# Altium schematic sheet EmitterConnector.SchDoc
size A4
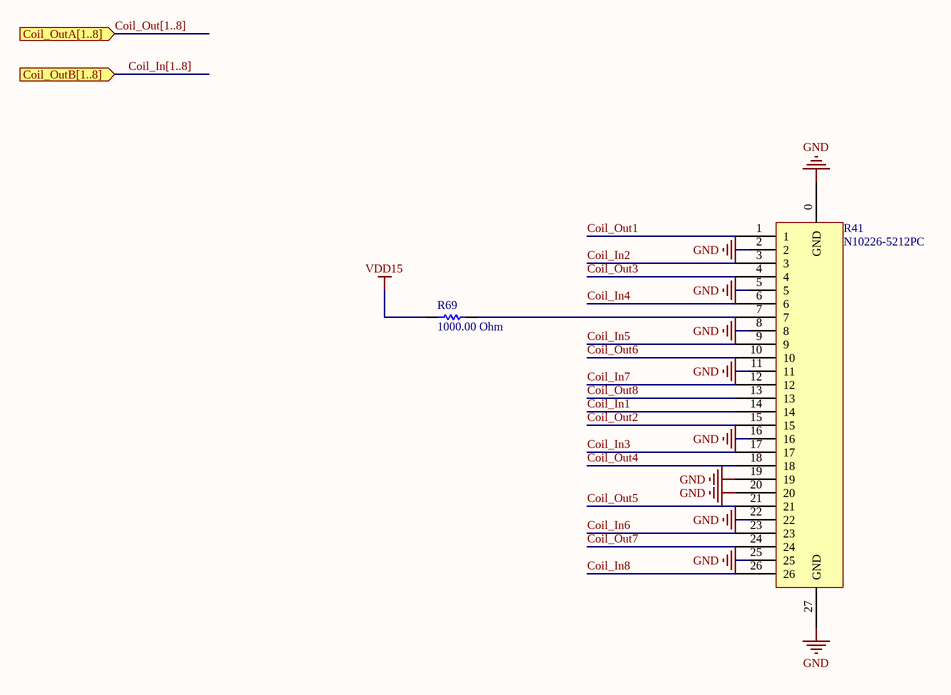
[diagram p0: EmitterConnector.SchDoc]

## Parts
R41  N10226-5212PC  [CONN MINI-D 26POS R/A RECPT]
R69  value 1000.00 Ohm  [RESC0603(1608)_L]  (hidden comment: 1K 5% 0603(1608))

## Ports
Coil_OutA[1..8] (in), Coil_OutB[1..8] (in)

## Nets
GND: R41.0(GND) R41.2 R41.5 R41.8 R41.11 R41.16 R41.19 R41.20 R41.22 R41.25 R41.27(GND)
VDD15: R69.1
Coil_In1: R41.14
Coil_In2: R41.3
Coil_In3: R41.17
Coil_In4: R41.6
Coil_In5: R41.9
Coil_In6: R41.23
Coil_In7: R41.12
Coil_In8: R41.26
Coil_Out1: R41.1
Coil_Out2: R41.15
Coil_Out3: R41.4
Coil_Out4: R41.18
Coil_Out5: R41.21
Coil_Out6: R41.10
Coil_Out7: R41.24
Coil_Out8: R41.13
NetR41_7: R41.7 R69.2

## Buses and harness runs
bus Coil_In[1..8] = port Coil_OutB[1..8]
bus Coil_Out[1..8] = port Coil_OutA[1..8]

## Library data of the parts
R41 = N10226-5212PC: CONN MINI-D 26POS R/A RECPT; Manufacturer: 3M; Connector Style: Outer Shroud Contacts; Connector Type: Receptacle; Number of Positions: 26; Flange Feature: Insert, Threaded (M2.5); Latchblocks; Published: 8-Jun-2000; LatestRevisionDate: 29-May-2009; LatestRevisionNote: IPC-7351 Footprint Added.; PackageReference: J1-0603; Publisher: Altium Limited; PackageDescription: Chip Resistor; Manufacturer Part Number: N10226-5212PC; RoHS: RoHS Compliant; Category: Connectors, Interconnects; Part Status: Active; Number of Rows: 2; Mounting Type: Panel Mount, Through Hole, Right Angle; Termination: Solder; Type: -; Features: Shielded; Contact Finish: Gold; Contact Finish Thickness: 30µin (0.76µm); ComponentLink1URL: http://multimedia.3m.com/mws/media/22325O/3mtm-mini-d-ribbonmdr-050-bm-thru-hole-ra-shielded-ts0531.pdf; ComponentLink1Description: http://multimedia.3m.com/mws/media/22325O/3mtm-mini-d-ribbonmdr-050-bm-thru-hole-ra-shielded-ts0531.pdf; Supplier 1: Digi-Key; Supplier Part Number 1: N10226-5212PC-ND; Stock 1: 782; Pricing 1: 1=7.63, 10=7.291, 25=6.6284, 50=6.2972, 100=6.1314, 250=5.4686, 500=5.13714, 1000=4.54056, 2500=4.30856 (EUR)
R69 = CMP-1012-00074-1: 1K 0.1W 5% 0603 (1608 Metric)  SMD; Case-EIA: 0603; Case-Metric: 1608; Technology: SMT; Tolerance: 5 %; Power: 0.1 W; OrderURL: http://www.digikey.ie/product-detail/en/yageo/RC0603JR-071KL/311-1.0KGRCT-ND/729624; Supplier 1: Digi-Key; Supplier Part Number 1: 311-1.0KGRCT-ND